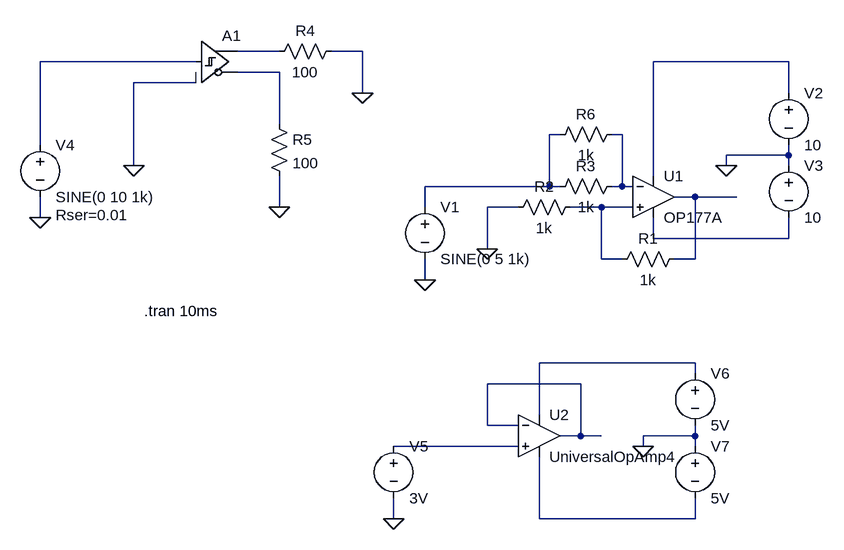
[diagram p0: schematic Shumitt_Volatage Follower.asc]
Shumitt_Volatage Follower.asc, the LTspice schematic file:
Version 4
SHEET 1 1096 680
WIRE 256 -800 192 -800
WIRE 384 -800 336 -800
WIRE 128 -784 -112 -784
WIRE 1040 -784 832 -784
WIRE 256 -768 192 -768
WIRE 128 -752 32 -752
WIRE 384 -736 384 -800
WIRE 1040 -736 1040 -784
WIRE 256 -688 256 -768
WIRE 688 -672 672 -672
WIRE 784 -672 768 -672
WIRE -112 -656 -112 -784
WIRE 1040 -640 1040 -656
WIRE 1040 -640 944 -640
WIRE 32 -624 32 -752
WIRE 944 -624 944 -640
WIRE 1040 -624 1040 -640
WIRE 832 -608 832 -784
WIRE 672 -592 672 -672
WIRE 672 -592 480 -592
WIRE 688 -592 672 -592
WIRE 784 -592 784 -672
WIRE 784 -592 768 -592
WIRE 800 -592 784 -592
WIRE 896 -576 864 -576
WIRE 960 -576 896 -576
WIRE 256 -560 256 -608
WIRE 480 -560 480 -592
WIRE 624 -560 576 -560
WIRE 752 -560 704 -560
WIRE 800 -560 752 -560
WIRE -112 -544 -112 -576
WIRE 832 -512 832 -544
WIRE 1040 -512 1040 -544
WIRE 1040 -512 832 -512
WIRE 576 -496 576 -560
WIRE 752 -480 752 -560
WIRE 784 -480 752 -480
WIRE 896 -480 896 -576
WIRE 896 -480 864 -480
WIRE 480 -448 480 -480
WIRE 896 -320 656 -320
WIRE 896 -304 896 -320
WIRE 720 -288 576 -288
WIRE 656 -240 656 -320
WIRE 576 -224 576 -288
WIRE 624 -224 576 -224
WIRE 720 -208 720 -288
WIRE 720 -208 688 -208
WIRE 752 -208 720 -208
WIRE 896 -208 896 -224
WIRE 896 -208 816 -208
WIRE 624 -192 432 -192
WIRE 816 -192 816 -208
WIRE 896 -192 896 -208
WIRE 432 -80 432 -112
WIRE 656 -80 656 -176
WIRE 896 -80 896 -112
WIRE 896 -80 656 -80
FLAG 384 -736 0
FLAG -112 -544 0
FLAG 256 -560 0
FLAG 32 -624 0
FLAG 576 -496 0
FLAG 480 -448 0
FLAG 944 -624 0
FLAG 432 -80 0
FLAG 816 -192 0
SYMBOL voltage -112 -672 R0
WINDOW 123 0 0 Left 0
WINDOW 39 24 124 Left 2
SYMATTR SpiceLine Rser=0.01
SYMATTR InstName V4
SYMATTR Value SINE(0 10 1k)
SYMBOL Digital\\schmitt 128 -848 R0
SYMATTR InstName A1
SYMBOL res 352 -816 R90
WINDOW 0 0 56 VBottom 2
WINDOW 3 32 56 VTop 2
SYMATTR InstName R4
SYMATTR Value 100
SYMBOL res 240 -704 R0
SYMATTR InstName R5
SYMATTR Value 100
SYMBOL res 880 -496 R90
WINDOW 0 0 56 VBottom 2
WINDOW 3 32 56 VTop 2
SYMATTR InstName R1
SYMATTR Value 1k
SYMBOL res 720 -576 R90
WINDOW 0 0 56 VBottom 2
WINDOW 3 32 56 VTop 2
SYMATTR InstName R2
SYMATTR Value 1k
SYMBOL res 784 -608 R90
WINDOW 0 0 56 VBottom 2
WINDOW 3 32 56 VTop 2
SYMATTR InstName R3
SYMATTR Value 1k
SYMBOL res 784 -688 R90
WINDOW 0 0 56 VBottom 2
WINDOW 3 32 56 VTop 2
SYMATTR InstName R6
SYMATTR Value 1k
SYMBOL voltage 480 -576 R0
WINDOW 123 0 0 Left 0
WINDOW 39 0 0 Left 0
SYMATTR InstName V1
SYMATTR Value SINE(0 5 1k)
SYMBOL OpAmps\\OP177A 832 -640 R0
SYMATTR InstName U1
SYMBOL voltage 1040 -752 R0
SYMATTR InstName V2
SYMATTR Value 10
SYMBOL voltage 1040 -640 R0
SYMATTR InstName V3
SYMATTR Value 10
SYMBOL OpAmps\\UniversalOpAmp4 656 -208 R0
SYMATTR InstName U2
SYMBOL voltage 432 -208 R0
SYMATTR InstName V5
SYMATTR Value 3V
SYMBOL voltage 896 -320 R0
SYMATTR InstName V6
SYMATTR Value 5V
SYMBOL voltage 896 -208 R0
WINDOW 123 0 0 Left 0
WINDOW 39 0 0 Left 0
SYMATTR InstName V7
SYMATTR Value 5V
TEXT 48 -400 Left 2 !.tran 10ms

The netlist it stands for:
* Shumitt_Volatage Follower.asc
V4 N002 0 SINE(0 10 1k) Rser=0.01
A1 N002 0 0 0 0 N004 N001 0 SCHMITT
R4 0 N001 100
R5 N004 0 100
R1 N007 N008 1k
R2 N008 0 1k
R3 N006 N005 1k
R6 N006 N005 1k
V1 N005 0 SINE(0 5 1k)
XU1 N008 N006 N003 N009 N007 OP177A  ; pins In+ In- V+ V- OUT
V2 N003 0 10
V3 0 N009 10
* U2: UniversalOpAmp4 (symbol OpAmps\UniversalOpAmp4 not available, pins judged from their places): In+=N012 In-=N011 V+=N010 V-=N013 OUT=N011
V5 N012 0 3V
V6 N010 0 5V
V7 0 N013 5V
.tran 10ms
.backanno
.end